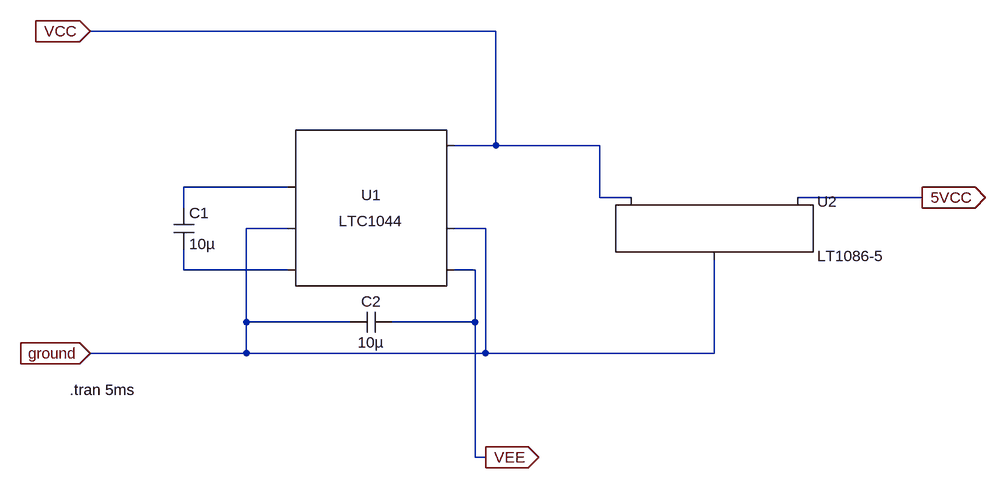
[diagram p0: schematic power_management.asc]
power_management.asc, the LTspice schematic file:
Version 4.1
SHEET 1 1032 680
WIRE 256 -176 -368 -176
WIRE 256 0 256 -176
WIRE 256 0 192 0
WIRE 416 0 256 0
WIRE -64 64 -224 64
WIRE 416 80 416 0
WIRE 464 80 416 80
WIRE 912 80 720 80
WIRE -224 96 -224 64
WIRE -64 128 -128 128
WIRE 240 128 192 128
WIRE -224 192 -224 160
WIRE -64 192 -224 192
WIRE 224 192 192 192
WIRE -128 272 -128 128
WIRE 32 272 -128 272
WIRE 224 272 224 192
WIRE 224 272 96 272
WIRE -128 320 -128 272
WIRE -128 320 -368 320
WIRE 240 320 240 128
WIRE 240 320 -128 320
WIRE 592 320 592 176
WIRE 592 320 240 320
WIRE 224 480 224 272
WIRE 240 480 224 480
FLAG -368 320 ground
IOPIN -368 320 In
FLAG -368 -176 VCC
IOPIN -368 -176 In
FLAG 240 480 VEE
IOPIN 240 480 Out
FLAG 912 80 5VCC
IOPIN 912 80 Out
SYMBOL PowerProducts\\LTC1044 64 96 R0
SYMATTR InstName U1
SYMBOL PowerProducts\\LT1086-5 592 80 R0
SYMATTR InstName U2
SYMBOL cap -240 96 R0
SYMATTR InstName C1
SYMATTR Value 10µ
SYMATTR SpiceLine Rser=0.1
SYMBOL cap 96 256 R90
WINDOW 0 0 32 VBottom 2
WINDOW 3 32 32 VTop 2
SYMATTR InstName C2
SYMATTR Value 10µ
SYMATTR SpiceLine Rser=0.1
TEXT -400 376 Left 2 !.tran 5ms

The netlist it stands for:
* power_management.asc
X§U1 NC_01 N001 ground N002 VEE ground NC_02 VCC LTC1044
X§U2 ground 5VCC VCC LT1086-5
C1 N001 N002 10µ Rser=0.1
C2 VEE ground 10µ Rser=0.1
.tran 5ms
.lib LTC1044.sub
.backanno
.end